# Altium schematic sheet TELEMETRY_SCH.SchDoc
size A
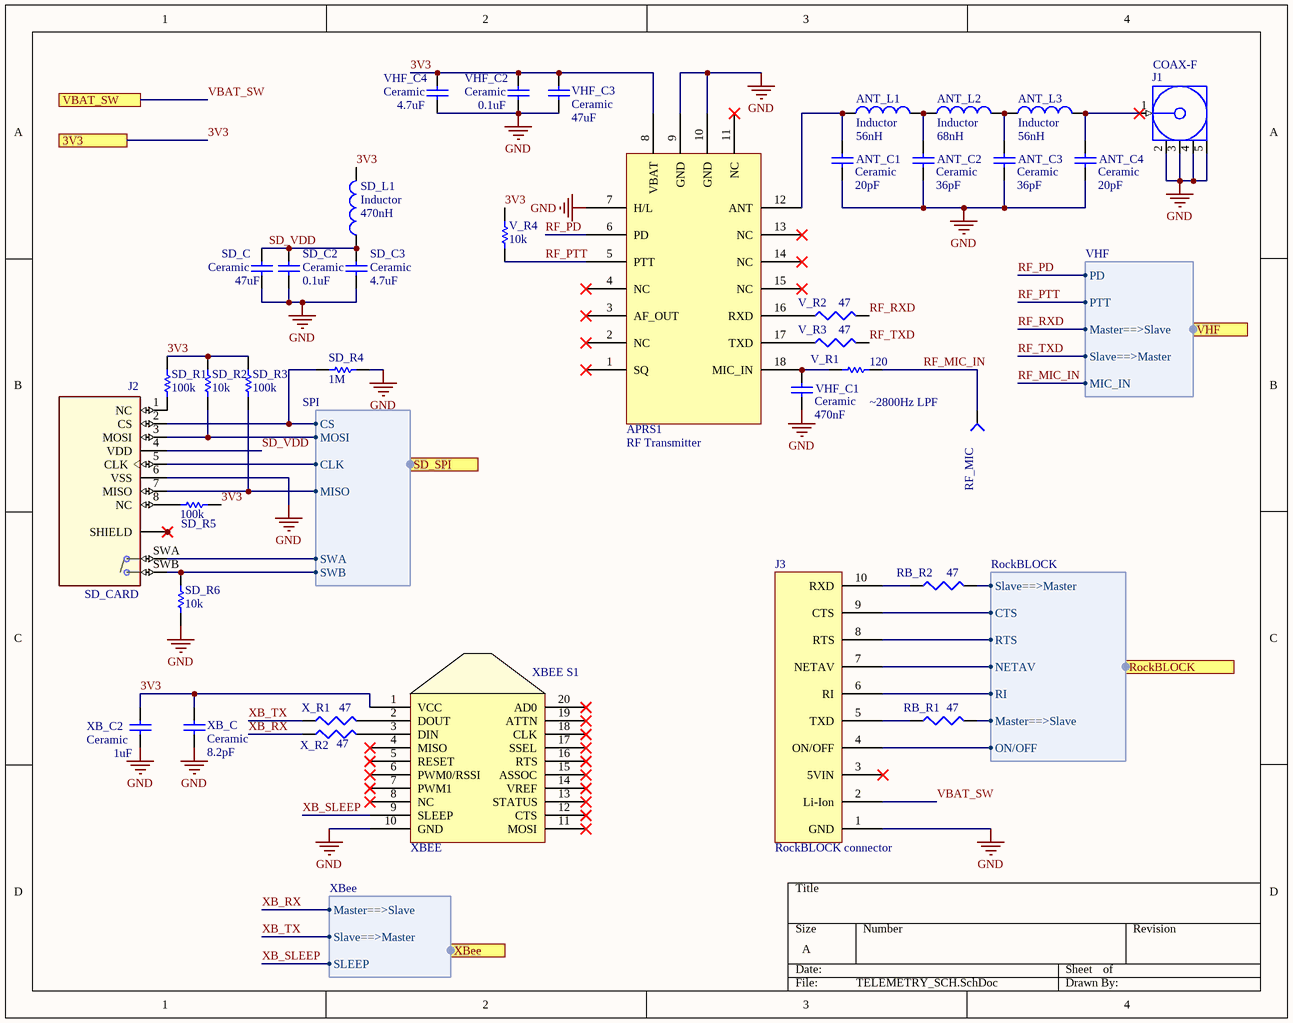
[diagram p0: TELEMETRY_SCH.SchDoc]

## Parts
ANT_C1  Ceramic  value 20pF  [1608[0603]]
ANT_C2  Ceramic  value 36pF  [1608[0603]]
ANT_C3  Ceramic  value 36pF  [1608[0603]]
ANT_C4  Ceramic  value 20pF  [1608[0603]]
ANT_L1  Inductor  value 56nH  [J1-0603]
ANT_L2  Inductor  value 68nH  [J1-0603]
ANT_L3  Inductor  value 56nH  [J1-0603]
APRS1  RF Transmitter  [APRS Transmitter]
J1  COAX-F  [MCX_RF_SMA_F]
J2  SD_CARD  [SD_CARD]
J3  RockBLOCK connector  [RockBLOCK Connector]
RB_R1  value 47  [J1-0603]  (hidden comment: Res3)
RB_R2  value 47  [J1-0603]  (hidden comment: Res3)
RF_MIC  Testpoint  [TESTPOINT]  (value not drawn)  (no BOM)
SD_C  Ceramic  value 47uF  [1608[0603]]
SD_C2  Ceramic  value 0.1uF  [1608[0603]]
SD_C3  Ceramic  value 4.7uF  [1608[0603]]
SD_L1  Inductor  value 470nH  [J1-0603]
SD_R1  value 100k  [J1-0603]  (hidden comment: Resistor)
SD_R2  value 10k  [J1-0603]  (hidden comment: Resistor)
SD_R3  value 100k  [J1-0603]  (hidden comment: Resistor)
SD_R4  value 1M  [J1-0603]  (hidden comment: Resistor)
SD_R5  value 100k  [J1-0603]  (hidden comment: Resistor)
SD_R6  value 10k  [J1-0603]  (hidden comment: Resistor)
V_R1  value 120  [J1-0603]  (hidden comment: Resistor)
V_R2  value 47  [J1-0603]  (hidden comment: Res3)
V_R3  value 47  [J1-0603]  (hidden comment: Res3)
V_R4  value 10k  [J1-0603]  (hidden comment: Resistor)
VHF_C1  Ceramic  value 470nF  [1608[0603]]
VHF_C2  Ceramic  value 0.1uF  [1608[0603]]
VHF_C3  Ceramic  value 47uF  [1608[0603]]
VHF_C4  Ceramic  value 4.7uF  [1608[0603]]
X_R1  value 47  [J1-0603]  (hidden comment: Res3)
X_R2  value 47  [J1-0603]  (hidden comment: Res3)
XB_C  Ceramic  value 8.2pF  [1608[0603]]
XB_C2  Ceramic  value 1uF  [1608[0603]]
XBEE_S1  XBEE  [XBEE]

## Ports
3V3, RockBLOCK (harness RockBLOCK), SD_SPI (harness SPI), VBAT_SW, VHF (harness VHF), XBee (harness XBee)

## Harnesses
RockBLOCK: ON/OFF, Master==>Slave, RI, NETAV, RTS, CTS, Slave==>Master
VHF: PD, PTT, Master==>Slave, Slave==>Master, MIC_IN
XBee: Master==>Slave, Slave==>Master, SLEEP
SPI: CS, MOSI, CLK, MISO, SWA, SWB

## Nets
GND: ANT_C1.1 ANT_C2.1 ANT_C3.1 ANT_C4.1 APRS1.7(H/L) APRS1.9(GND) APRS1.10(GND) J1.2(GND) J1.3(GND) J1.4(GND) J1.5(GND) J2.6(VSS) J3.1(GND) SD_C.1 SD_C2.1 SD_C3.1 SD_R4.1 SD_R6.1 VHF_C1.1 VHF_C2.1 VHF_C3.1 VHF_C4.1 XB_C.1 XB_C2.1 XBEE_S1.10(GND)
3V3: APRS1.8(VBAT) SD_L1.2 SD_R1.2 SD_R2.2 SD_R3.2 SD_R5.1 V_R4.2 VHF_C2.2 VHF_C3.2 VHF_C4.2 XB_C.2 XB_C2.2 XBEE_S1.1(VCC) ; port 3V3
RF_MIC_IN: RF_MIC.1 V_R1.2 ; port VHF.MIC_IN
RF_PD: APRS1.6(PD) ; port VHF.PD
RF_PTT: APRS1.5(PTT) V_R4.1 ; port VHF.PTT
RF_RXD: V_R2.2 ; port VHF.Master==>Slave
RF_TXD: V_R3.2 ; port VHF.Slave==>Master
SD_VDD: J2.4(VDD) SD_C.2 SD_C2.2 SD_C3.2 SD_L1.1
VBAT_SW: J3.2(Li-Ion) ; port VBAT_SW
XB_RX: X_R2.1 ; port XBee.Master==>Slave
XB_SLEEP: XBEE_S1.9(SLEEP) ; port XBee.SLEEP
XB_TX: X_R1.1 ; port XBee.Slave==>Master
NetANT_C1_2: ANT_C1.2 ANT_L1.1 APRS1.12(ANT)
NetANT_C2_2: ANT_C2.2 ANT_L1.2 ANT_L2.1
NetANT_C3_2: ANT_C3.2 ANT_L2.2 ANT_L3.1
NetANT_C4_2: ANT_C4.2 ANT_L3.2 J1.1(Signal)
NetAPRS1_16: APRS1.16(RXD) V_R2.1
NetAPRS1_17: APRS1.17(TXD) V_R3.1
NetAPRS1_18: APRS1.18(MIC_IN) V_R1.1 VHF_C1.2
NetJ2_1: J2.1(NC) SD_R1.1
NetJ2_2: J2.2(CS) SD_R4.2 ; port SD_SPI.CS
NetJ2_3: J2.3(MOSI) SD_R2.1 ; port SD_SPI.MOSI
NetJ2_5: J2.5(CLK) ; port SD_SPI.CLK
NetJ2_7: J2.7(MISO) SD_R3.1 ; port SD_SPI.MISO
NetJ2_8: J2.8(NC) SD_R5.2
NetJ2_P1: J2.P1(SHIELD) J2.P2(SHIELD) J2.P3(SHIELD) J2.P4(SHIELD)
NetJ2_SWA: J2.SWA(A) ; port SD_SPI.SWA
NetJ2_SWB: J2.SWB(B) SD_R6.2 ; port SD_SPI.SWB
NetJ3_4: J3.4(ON/OFF) ; port RockBLOCK.ON/OFF
NetJ3_5: J3.5(TXD) RB_R1.1
NetJ3_6: J3.6(RI) ; port RockBLOCK.RI
NetJ3_7: J3.7(NETAV) ; port RockBLOCK.NETAV
NetJ3_8: J3.8(RTS) ; port RockBLOCK.RTS
NetJ3_9: J3.9(CTS) ; port RockBLOCK.CTS
NetJ3_10: J3.10(RXD) RB_R2.1
NetRB_R1_2: RB_R1.2 ; port RockBLOCK.Master==>Slave
NetRB_R2_2: RB_R2.2 ; port RockBLOCK.Slave==>Master
NetX_R1_2: X_R1.2 XBEE_S1.2(DOUT)
NetX_R2_2: X_R2.2 XBEE_S1.3(DIN)

Not connected (* = marked no-connect by the designer): APRS1 1(SQ)* 2(NC)* 3(AF_OUT)* 4(NC)* 11(NC)* 13(NC)* 14(NC)* 15(NC)*; J3 3(5VIN)*; XBEE_S1 4(MISO)* 5(RESET)* 6(PWM0/RSSI)* 7(PWM1)* 8(NC)* 11(MOSI)* 12(CTS)* 13(STATUS)* 14(VREF)* 15(ASSOC)* 16(RTS)* 17(SSEL)* 18(CLK)* 19(ATTN)* 20(AD0)*

## Notes on the sheet
- ~2800Hz LPF

## Library data of the parts
ANT_C1-ANT_C4 SD_C SD_C2 SD_C3 VHF_C1-VHF_C4 XB_C XB_C2 = Cap: Capacitor; Published: 8-Jun-2000; LatestRevisionDate: 17-Jul-2002; LatestRevisionNote: Re-released for DXP Platform.; PackageReference: RAD-0.3; Publisher: Altium Limited; PackageDescription: Radial Cap, Thru-Hole; 2 Leads; 0.3 in Pin Spacing
ANT_L1-ANT_L3 SD_L1 = Inductor: Code_IEC: 1005; Published: 8-Jun-2000; LatestRevisionDate: 29-May-2009; LatestRevisionNote: IPC-7351 Footprint Added.; PackageReference: 0402-A; Publisher: Altium Limited; PackageDescription: Chip Inductor; Code_JEITA: 0402
APRS1 = RF Transmitter: DRA818V
J1 = COAX-F: RF Coaxial PCB Connector, MCX; Thru-Hole, Right-Angle Mount Socket, Blunt Post Terminal, 50 Ohm Impedance; PCB_Layout: Complies with manufacturer's recommendation.; DrillSize: Corresponds to nominal value.; Published: 15-Jul-2004; LatestRevisionDate: 15-Jul-2004; LatestRevisionNote: Component Replaced.; DatasheetDocument: 30-May-2003; PackageDocument: 04-Jul-1999; PackageReference: 919-119J-51AX; Publisher: Altium Limited; ComponentLink1Description: Manufacturer Link; ComponentLink1URL: http://www.amphenolrf.com/
J2 = DM3AT-SF-PEJM5: DM3 RA SMT microSD memory card push/push; MF: Hirose; Digi-Key_Part_Number: HR1964CT-ND; Package: None; SnapEDA_Link: https://www.snapeda.com/parts/DM3AT-SF-PEJM5/Hirose%20Electric%20Co%20Ltd/view-part/?ref=snap; Digi-Key_Purchase_URL: https://www.digikey.com/product-detail/en/hirose-electric-co-ltd/DM3AT-SF-PEJM5/HR1964CT-ND/2533566?utm_source=snapeda&utm_medium=aggregator&utm_campaign=symbol; MP: DM3AT-SF-PEJM5; Value: *
RB_R1 RB_R2 V_R2 V_R3 X_R1 X_R2 = Res3: Resistor; Published: 8-Jun-2000; LatestRevisionDate: 29-May-2009; LatestRevisionNote: IPC-7351 Footprint Added.; PackageReference: J1-0603; Publisher: Altium Limited; PackageDescription: Chip Resistor
RF_MIC = Testpoint: Probe point for testing
SD_R1-SD_R6 V_R1 V_R4 = Resistor: Resistive element
XBEE_S1 = XBEE: XB24CZ7WIT-004